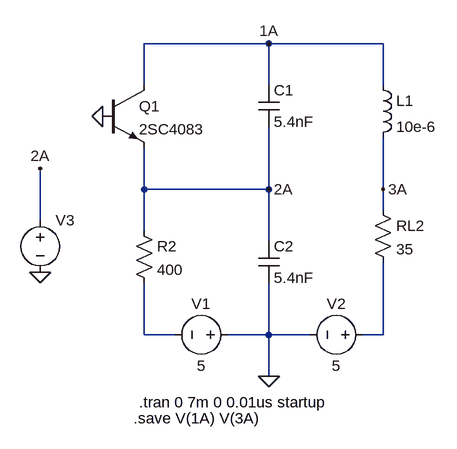
[diagram p0: schematic C_RX.asc]
C_RX.asc, the LTspice schematic file:
Version 4
SHEET 1 996 708
WIRE -16 -16 -208 -16
WIRE 160 -16 -16 -16
WIRE -208 48 -208 -16
WIRE -16 48 -16 -16
WIRE 160 48 160 -16
WIRE -208 208 -208 144
WIRE -16 208 -16 112
WIRE -16 208 -208 208
WIRE 160 208 160 128
WIRE 160 240 160 208
WIRE -368 256 -368 176
WIRE -208 272 -208 208
WIRE -16 288 -16 208
WIRE -208 432 -208 352
WIRE -160 432 -208 432
WIRE -16 432 -16 352
WIRE -16 432 -80 432
WIRE 48 432 -16 432
WIRE 160 432 160 320
WIRE 160 432 128 432
WIRE -16 496 -16 432
FLAG -272 96 0
FLAG -16 496 0
FLAG -16 -16 1A
FLAG -16 208 2A
FLAG 160 208 3A
FLAG -368 336 0
FLAG -368 176 2A
SYMBOL ind 144 32 R0
SYMATTR InstName L1
SYMATTR Value 10e-6
SYMBOL cap -32 48 R0
SYMATTR InstName C1
SYMATTR Value 5.4nF
SYMBOL res 144 224 R0
SYMATTR InstName RL2
SYMATTR Value 35
SYMBOL res -224 256 R0
SYMATTR InstName R2
SYMATTR Value 400
SYMBOL voltage -64 432 R90
WINDOW 0 -32 56 VBottom 2
WINDOW 3 32 56 VTop 2
WINDOW 123 0 0 Left 0
WINDOW 39 0 0 Left 0
SYMATTR InstName V1
SYMATTR Value 5
SYMBOL voltage 144 432 R90
WINDOW 0 -32 56 VBottom 2
WINDOW 3 32 56 VTop 2
WINDOW 123 0 0 Left 0
WINDOW 39 0 0 Left 0
SYMATTR InstName V2
SYMATTR Value 5
SYMBOL npn -272 48 R0
SYMATTR InstName Q1
SYMATTR Value 2SC4083
SYMBOL voltage -368 240 R0
WINDOW 3 24 96 Invisible 2
WINDOW 123 0 0 Left 0
WINDOW 39 0 0 Left 0
SYMATTR Value PWL file=Sync_1.txt
SYMATTR InstName V3
SYMBOL cap -32 288 R0
SYMATTR InstName C2
SYMATTR Value 5.4nF
TEXT -216 536 Left 2 !.tran 0 7m 0 0.01us startup
TEXT -224 560 Left 2 !.save V(1A) V(3A)

The netlist it stands for:
* C_RX.asc
L1 1A 3A 10e-6
C1 1A 2A 5.4nF
RL2 3A N002 35
R2 2A N001 400
V1 0 N001 5
V2 N002 0 5
Q1 1A 0 2A 0 2SC4083
V3 2A 0 PWL file=Sync_1.txt
C2 2A 0 5.4nF
.model NPN NPN
.model PNP PNP
.lib standard.bjt
.tran 0 7m 0 0.01us startup
.save V(1A) V(3A)
.backanno
.end